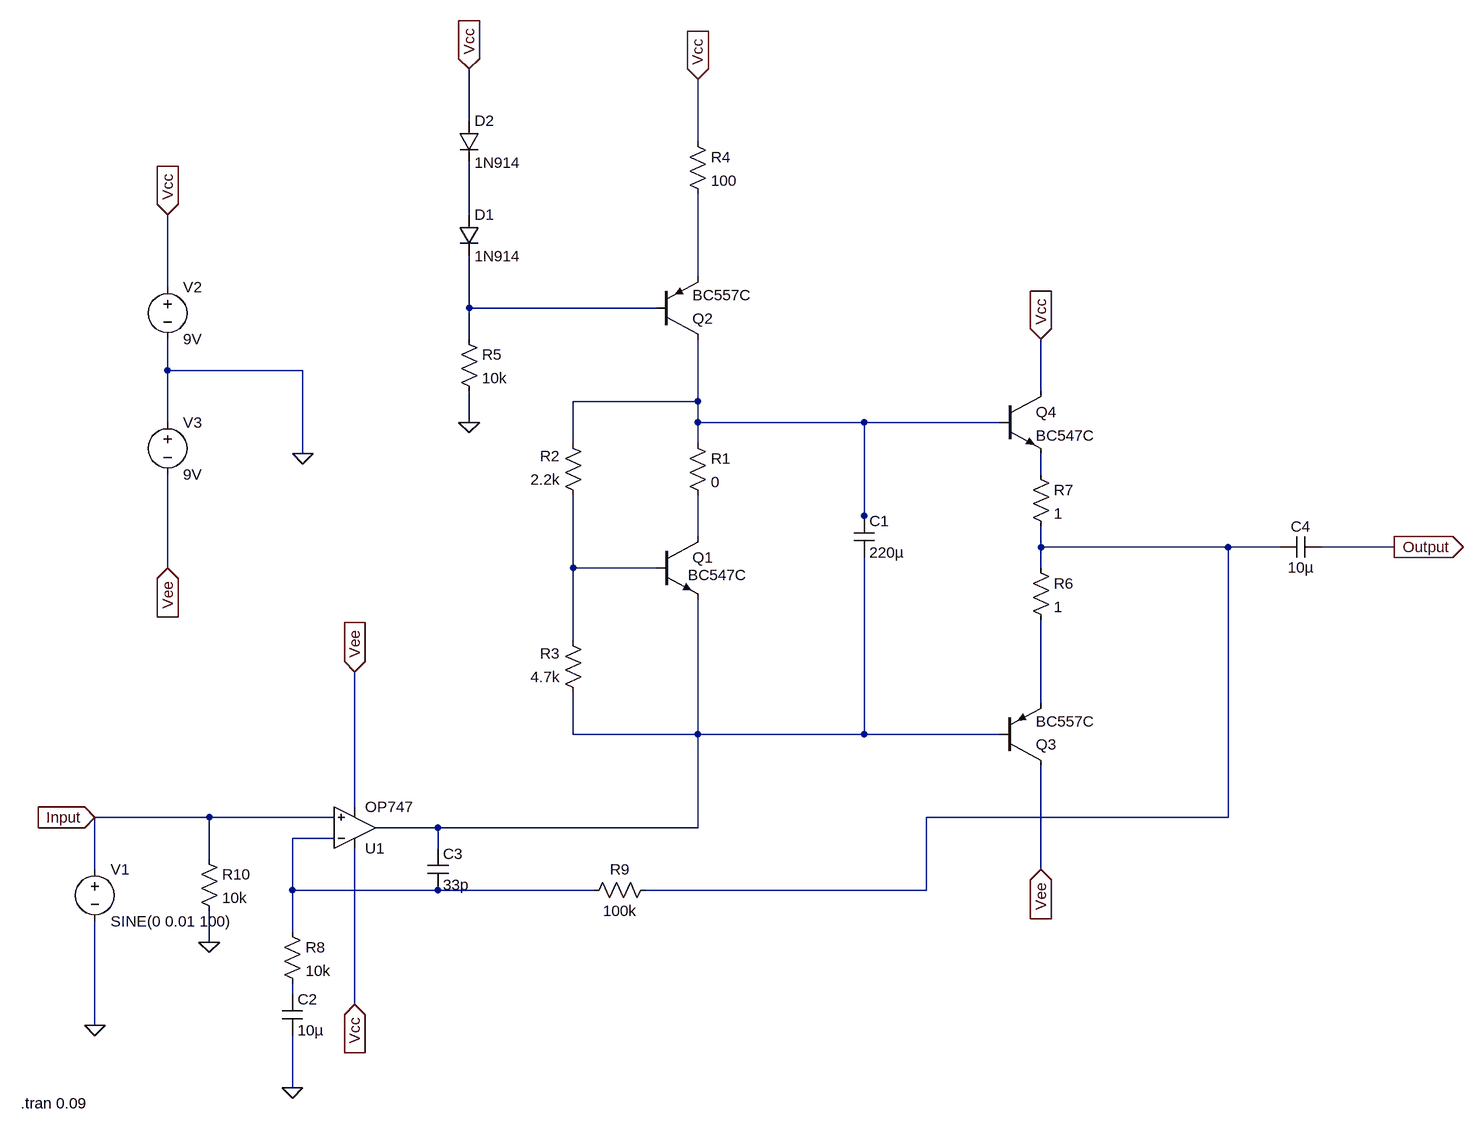
[diagram p0: schematic Simulation Circuit.asc]
Simulation Circuit.asc, the LTspice schematic file:
Version 4
SHEET 1 1480 1080
WIRE -80 -448 -80 -528
WIRE 272 -416 272 -512
WIRE -80 -304 -80 -384
WIRE 272 -208 272 -336
WIRE -544 -192 -544 -304
WIRE -80 -160 -80 -240
WIRE 208 -160 -80 -160
WIRE -80 -112 -80 -160
WIRE -544 -64 -544 -112
WIRE -336 -64 -544 -64
WIRE 800 -32 800 -112
WIRE 272 -16 272 -112
WIRE 272 -16 80 -16
WIRE -544 16 -544 -64
WIRE -80 16 -80 -32
WIRE 272 16 272 -16
WIRE 528 16 272 16
WIRE 736 16 528 16
WIRE 80 48 80 -16
WIRE 272 48 272 16
WIRE -336 64 -336 -64
WIRE 800 96 800 64
WIRE 528 160 528 16
WIRE 528 176 528 160
WIRE 272 192 272 128
WIRE 800 208 800 176
WIRE 1088 208 800 208
WIRE 1168 208 1088 208
WIRE 1344 208 1232 208
WIRE -544 240 -544 96
WIRE 80 240 80 128
WIRE 208 240 80 240
WIRE 800 240 800 208
WIRE 80 352 80 240
WIRE 800 448 800 320
WIRE 80 496 80 432
WIRE 272 496 272 288
WIRE 272 496 80 496
WIRE 528 496 528 224
WIRE 528 496 272 496
WIRE 736 496 528 496
WIRE -256 608 -256 400
WIRE -480 624 -656 624
WIRE -288 624 -480 624
WIRE 1088 624 1088 208
WIRE 1088 624 624 624
WIRE -128 640 -224 640
WIRE 272 640 272 496
WIRE 272 640 -128 640
WIRE -288 656 -352 656
WIRE -128 672 -128 640
WIRE -480 688 -480 624
WIRE -656 704 -656 624
WIRE 800 704 800 544
WIRE -352 736 -352 656
WIRE -128 736 -352 736
WIRE 112 736 -128 736
WIRE 624 736 624 624
WIRE 624 736 192 736
WIRE -352 800 -352 736
WIRE -480 816 -480 768
WIRE -352 896 -352 880
WIRE -256 912 -256 672
WIRE -656 944 -656 784
WIRE -352 1040 -352 960
FLAG 272 -512 Vcc
IOPIN 272 -512 In
FLAG -80 -528 Vcc
IOPIN -80 -528 In
FLAG -80 16 0
FLAG 800 704 Vee
IOPIN 800 704 In
FLAG 800 -112 Vcc
IOPIN 800 -112 In
FLAG -256 400 Vee
IOPIN -256 400 In
FLAG -256 912 Vcc
IOPIN -256 912 In
FLAG -352 1040 0
FLAG 1344 208 Output
IOPIN 1344 208 Out
FLAG -480 816 0
FLAG -544 -304 Vcc
IOPIN -544 -304 In
FLAG -336 64 0
FLAG -544 240 Vee
IOPIN -544 240 In
FLAG -656 944 0
FLAG -656 624 Input
IOPIN -656 624 In
SYMBOL npn 208 192 R0
WINDOW 3 49 59 Left 2
SYMATTR InstName Q1
SYMATTR Value BC547C
SYMBOL res 256 32 R0
SYMATTR InstName R1
SYMATTR Value 0
SYMBOL res 96 144 R180
WINDOW 0 36 76 Left 2
WINDOW 3 36 40 Left 2
SYMATTR InstName R2
SYMATTR Value 2.2k
SYMBOL res 96 448 R180
WINDOW 0 36 76 Left 2
WINDOW 3 36 40 Left 2
SYMATTR InstName R3
SYMATTR Value 4.7k
SYMBOL res 256 -432 R0
SYMATTR InstName R4
SYMATTR Value 100
SYMBOL diode -96 -304 R0
SYMATTR InstName D1
SYMATTR Value 1N914
SYMBOL diode -96 -448 R0
SYMATTR InstName D2
SYMATTR Value 1N914
SYMBOL res -96 -128 R0
SYMATTR InstName R5
SYMATTR Value 10k
SYMBOL pnp 736 544 M180
SYMATTR InstName Q3
SYMATTR Value BC557C
SYMBOL res 784 224 R0
SYMATTR InstName R6
SYMATTR Value 1
SYMBOL res 784 80 R0
SYMATTR InstName R7
SYMATTR Value 1
SYMBOL npn 736 -32 R0
SYMATTR InstName Q4
SYMATTR Value BC547C
SYMBOL pnp 208 -112 M180
SYMATTR InstName Q2
SYMATTR Value BC557C
SYMBOL res -368 784 R0
SYMATTR InstName R8
SYMATTR Value 10k
SYMBOL cap -368 896 R0
SYMATTR InstName C2
SYMATTR Value 10µ
SYMBOL cap -144 672 R0
SYMATTR InstName C3
SYMATTR Value 33p
SYMBOL res 208 720 R90
WINDOW 0 0 56 VBottom 2
WINDOW 3 32 56 VTop 2
SYMATTR InstName R9
SYMATTR Value 100k
SYMBOL res -496 672 R0
SYMATTR InstName R10
SYMATTR Value 10k
SYMBOL voltage -544 -208 R0
WINDOW 123 0 0 Left 2
WINDOW 39 0 0 Left 2
SYMATTR InstName V2
SYMATTR Value 9V
SYMBOL voltage -544 0 R0
WINDOW 123 0 0 Left 2
WINDOW 39 0 0 Left 2
SYMATTR InstName V3
SYMATTR Value 9V
SYMBOL cap 1232 192 R90
WINDOW 0 0 32 VBottom 2
WINDOW 3 32 32 VTop 2
SYMATTR InstName C4
SYMATTR Value 10µ
SYMBOL Opamps\\OP747 -256 704 M180
SYMATTR InstName U1
SYMBOL cap 512 160 R0
SYMATTR InstName C1
SYMATTR Value 220µ
SYMBOL voltage -656 688 R0
WINDOW 123 0 0 Left 2
WINDOW 39 0 0 Left 2
SYMATTR InstName V1
SYMATTR Value SINE(0 0.01 100)
TEXT -770 1064 Left 2 !.tran 0.09

The netlist it stands for:
* Simulation Circuit.asc
Q1 N006 N008 N010 0 BC547C
R1 N004 N006 0
R2 N008 N004 2.2k
R3 N010 N008 4.7k
R4 Vcc N002 100
D1 N001 N003 1N914
D2 Vcc N001 1N914
R5 N003 0 10k
Q3 Vee N010 N009 0 BC557C
R6 N007 N009 1
R7 N005 N007 1
Q4 Vcc N004 N005 0 BC547C
Q2 N004 N003 N002 0 BC557C
R8 N011 N012 10k
C2 N012 0 10µ
C3 N010 N011 33p
R9 N007 N011 100k
R10 Input 0 10k
V2 Vcc 0 9V
V3 0 Vee 9V
C4 Output N007 10µ
XU1 Input N011 Vcc Vee N010 OP747  ; pins In+ In- V+ V- OUT
C1 N004 N010 220µ
V1 Input 0 SINE(0 0.01 100)
.model D D
.lib standard.dio
.model NPN NPN
.model PNP PNP
.lib standard.bjt
.tran 0.09
.backanno
.end